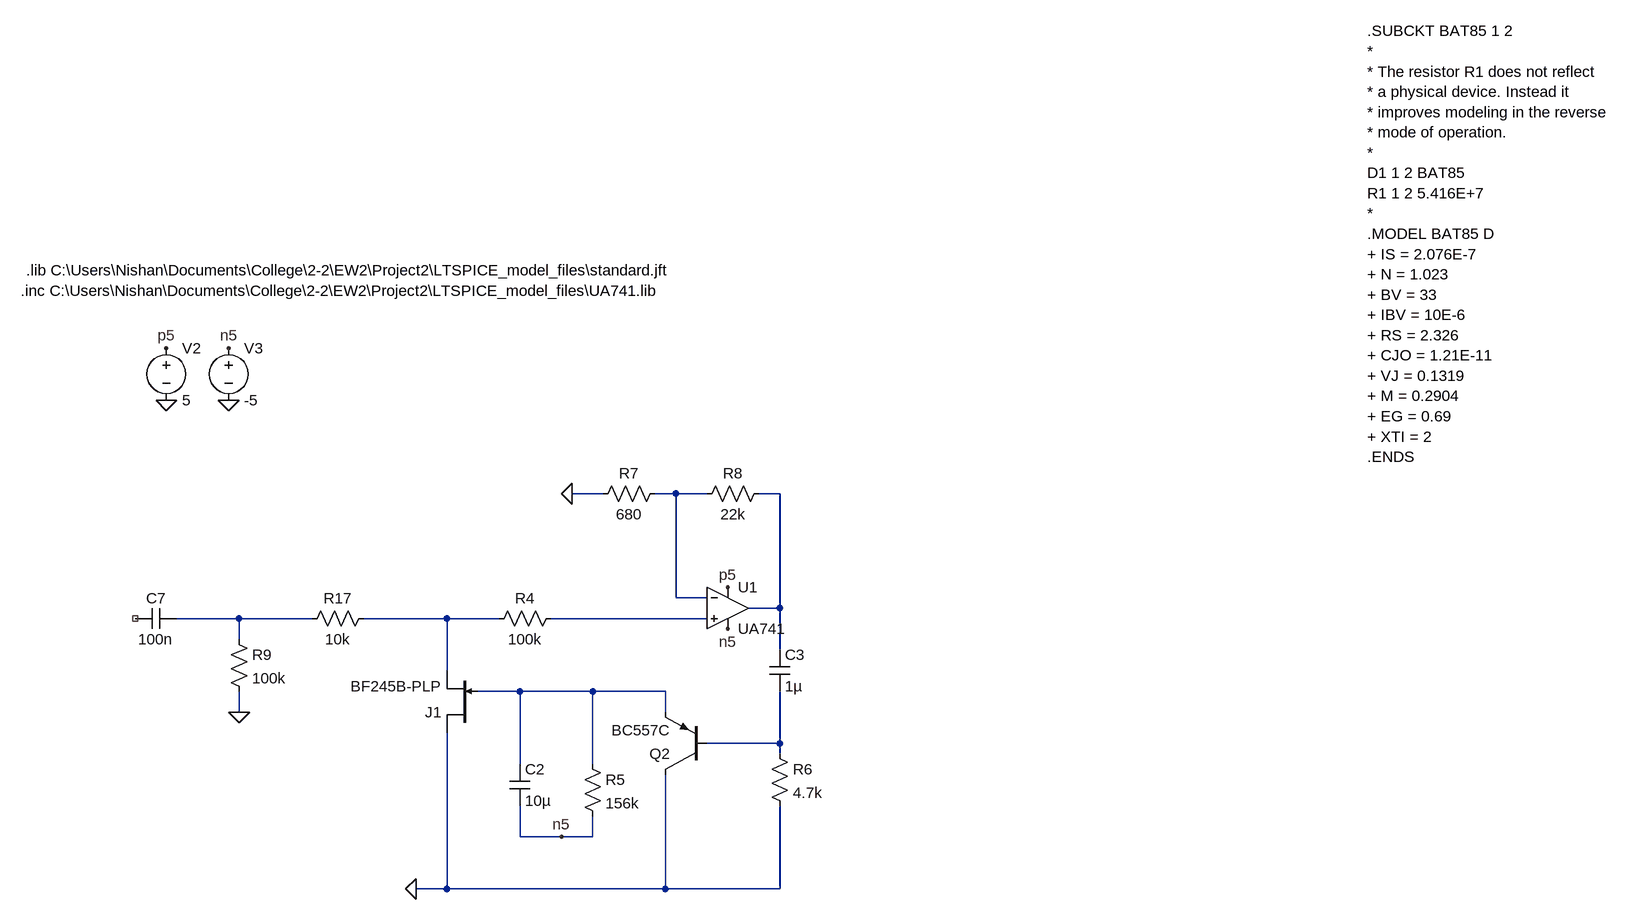
[diagram p0: schematic AGC.asc]
AGC.asc, the LTspice schematic file:
Version 4.1
SHEET 1 4496 2220
WIRE 688 384 640 384
WIRE 800 384 768 384
WIRE 848 384 800 384
WIRE 960 384 928 384
WIRE 800 544 800 384
WIRE 848 544 800 544
WIRE 960 560 960 384
WIRE 960 560 912 560
WIRE 128 576 32 576
WIRE 240 576 128 576
WIRE 448 576 320 576
WIRE 528 576 448 576
WIRE 848 576 608 576
WIRE 128 608 128 576
WIRE 960 624 960 560
WIRE 448 656 448 576
WIRE 560 688 496 688
WIRE 672 688 560 688
WIRE 784 688 672 688
WIRE 128 720 128 688
WIRE 784 720 784 688
WIRE 960 768 960 688
WIRE 960 768 848 768
WIRE 960 784 960 768
WIRE 560 800 560 688
WIRE 672 800 672 688
WIRE 560 912 560 864
WIRE 624 912 560 912
WIRE 672 912 672 880
WIRE 672 912 624 912
WIRE 448 992 448 752
WIRE 448 992 400 992
WIRE 784 992 784 816
WIRE 784 992 448 992
WIRE 960 992 960 864
WIRE 960 992 784 992
FLAG 400 992 0
FLAG 640 384 0
FLAG 624 912 n5
FLAG 880 592 n5
FLAG 880 528 p5
FLAG 16 240 0
FLAG 112 240 0
FLAG 16 160 p5
FLAG 112 160 n5
FLAG 128 720 0
DATAFLAG 960 560 ""
DATAFLAG 960 768 ""
DATAFLAG 560 688 ""
DATAFLAG 448 576 ""
DATAFLAG 448 992 ""
SYMBOL njf 496 752 R180
SYMATTR InstName J1
SYMATTR Value BF245B-PLP
SYMBOL res 624 560 R90
WINDOW 0 0 56 VBottom 2
WINDOW 3 32 56 VTop 2
SYMATTR InstName R4
SYMATTR Value 100k
SYMBOL cap 544 800 R0
SYMATTR InstName C2
SYMATTR Value 10µ
SYMBOL res 656 784 R0
SYMATTR InstName R5
SYMATTR Value 156k
SYMBOL pnp 848 816 R180
SYMATTR InstName Q2
SYMATTR Value BC557C
SYMBOL res 944 768 R0
SYMATTR InstName R6
SYMATTR Value 4.7k
SYMBOL cap 944 624 R0
SYMATTR InstName C3
SYMATTR Value 1µ
SYMBOL OpAmps\\opamp2 880 496 R0
SYMATTR InstName U1
SYMATTR Value UA741
SYMBOL res 784 368 R90
WINDOW 0 0 56 VBottom 2
WINDOW 3 32 56 VTop 2
SYMATTR InstName R7
SYMATTR Value 680
SYMBOL res 944 368 R90
WINDOW 0 0 56 VBottom 2
WINDOW 3 32 56 VTop 2
SYMATTR InstName R8
SYMATTR Value 22k
SYMBOL voltage 16 144 R0
WINDOW 123 0 0 Left 0
WINDOW 39 0 0 Left 0
SYMATTR InstName V2
SYMATTR Value 5
SYMBOL voltage 112 144 R0
WINDOW 123 0 0 Left 0
WINDOW 39 0 0 Left 0
SYMATTR InstName V3
SYMATTR Value -5
SYMBOL cap 32 560 R90
WINDOW 0 0 32 VBottom 2
WINDOW 3 32 32 VTop 2
SYMATTR InstName C7
SYMATTR Value 100n
SYMBOL res 112 592 R0
SYMATTR InstName R9
SYMATTR Value 100k
SYMBOL res 336 560 R90
WINDOW 0 0 56 VBottom 2
WINDOW 3 32 56 VTop 2
SYMATTR InstName R17
SYMATTR Value 10k
TEXT -200 40 Left 2 !.lib C:\\Users\\Nishan\\Documents\\College\\2-2\\EW2\\Project2\\LTSPICE_model_files\\standard.jft
TEXT -208 72 Left 2 !.inc C:\\Users\\Nishan\\Documents\\College\\2-2\\EW2\\Project2\\LTSPICE_model_files\\UA741.lib
TEXT 1864 -328 Left 2 !.SUBCKT BAT85 1 2\n*\n* The resistor R1 does not reflect\n* a physical device. Instead it\n* improves modeling in the reverse\n* mode of operation.\n*\nD1 1 2 BAT85\nR1 1 2 5.416E+7 \n* \n.MODEL BAT85 D \n+ IS = 2.076E-7 \n+ N = 1.023 \n+ BV = 33 \n+ IBV = 10E-6 \n+ RS = 2.326 \n+ CJO = 1.21E-11 \n+ VJ = 0.1319 \n+ M = 0.2904 \n+ EG = 0.69 \n+ XTI = 2 \n.ENDS

The netlist it stands for:
* AGC.asc
J1 0 N006 N004 BF245B-PLP
R4 N005 N004 100k
C2 N006 n5 10µ
R5 N006 n5 156k
Q2 0 N007 N006 0 BC557C
R6 N007 0 4.7k
C3 N002 N007 1µ
X§U1 N005 N001 p5 n5 N002 UA741  ; pins In+ In- V+ V- OUT
R7 N001 0 680
R8 N002 N001 22k
V2 p5 0 5
V3 n5 0 -5
C7 N003 NC_01 100n
R9 N003 0 100k
R17 N004 N003 10k
.model NPN NPN
.model PNP PNP
.lib standard.bjt
.model NJF NJF
.model PJF PJF
.lib standard.jft
.lib C:\Users\Nishan\Documents\College\2-2\EW2\Project2\LTSPICE_model_files\standard.jft
.inc C:\Users\Nishan\Documents\College\2-2\EW2\Project2\LTSPICE_model_files\UA741.lib
.SUBCKT BAT85 1 2
*
* The resistor R1 does not reflect
* a physical device. Instead it
* improves modeling in the reverse
* mode of operation.
*
D1 1 2 BAT85
R1 1 2 5.416E+7
*
.MODEL BAT85 D
+ IS = 2.076E-7
+ N = 1.023
+ BV = 33
+ IBV = 10E-6
+ RS = 2.326
+ CJO = 1.21E-11
+ VJ = 0.1319
+ M = 0.2904
+ EG = 0.69
+ XTI = 2
.ENDS
.backanno
.end